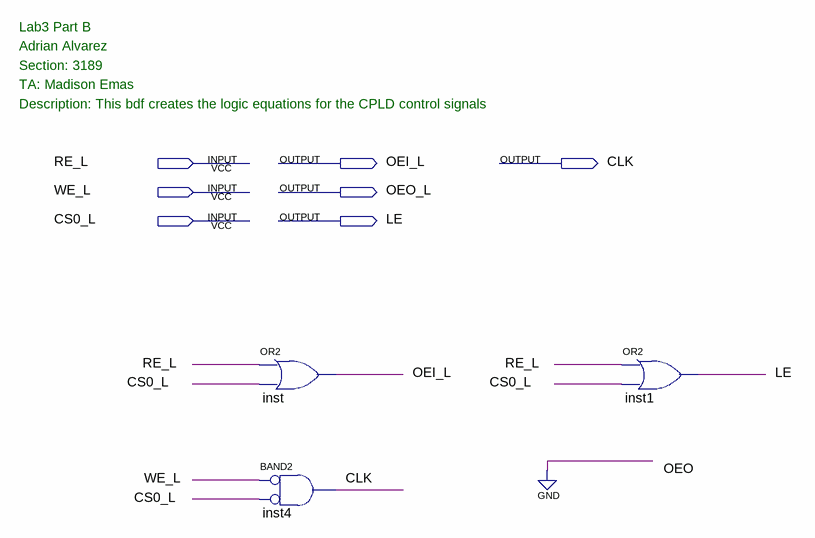
[diagram p0: schematic sheet]
// Quartus schematic lab3a.bdf as structural Verilog: 3 symbols, 7 pins
module lab3a (
  input  RE_L,
  input  WE_L,
  input  CS0_L,
  output OEI_L,
  output CLK,
  output OEO_L,
  output LE
);

  or inst (OEI_L, RE_L, CS0_L);
  and inst4 (CLK, ~WE_L, ~CS0_L);  // BAND2
  or inst1 (LE, RE_L, CS0_L);

  // Notes on the sheet:
  //   Lab3 Part B
  //   Adrian Alvarez
  //   Section: 3189
  //   TA: Madison Emas
  //   Description: This bdf creates the logic equations for the CPLD control signals
endmodule
